# Altium schematic sheet Trap_PCB_SMT2024.SchDoc
size A4; SheetNumber: 1; SheetTotal: 1
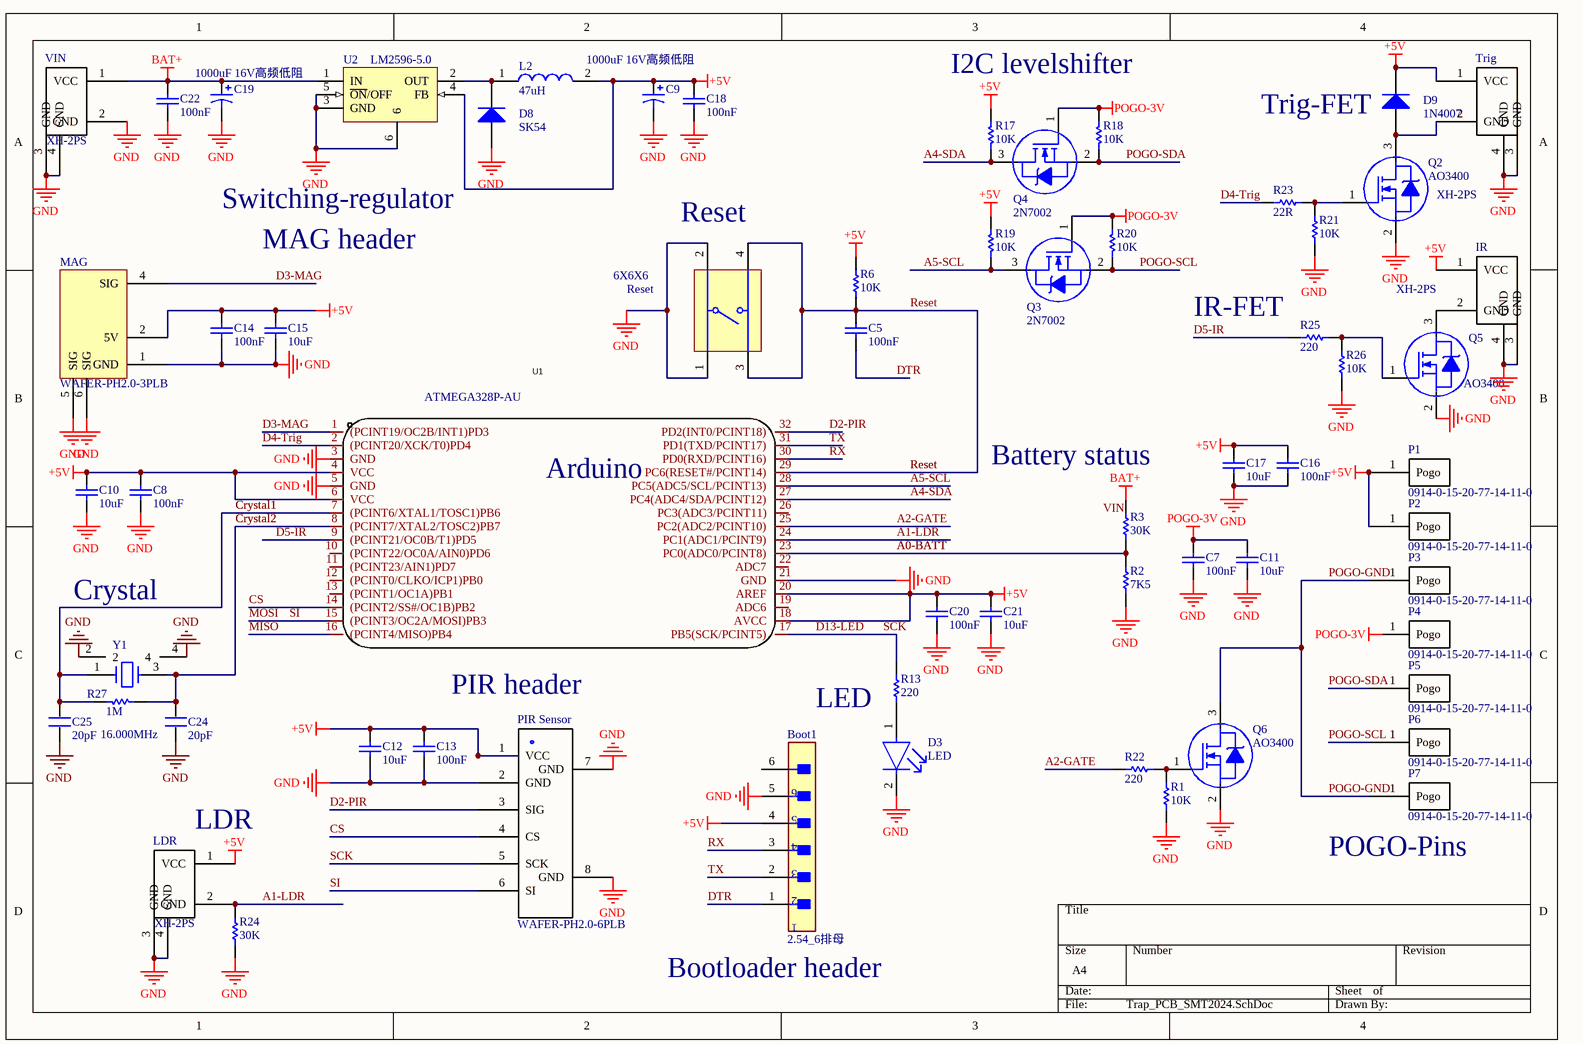
[diagram p0: Trap_PCB_SMT2024.SchDoc]

## Parts
Boot1  2.54_6排母  [FP-SWR25X-NRTC-S06-ST-BA-MFG]
C5  100nF  [0603C]
C7  100nF  [0603C]
C8  100nF  [0603C]
C9  1000uF 16V高频低阻  [CAP-SMD_BD10.0-L10.3-W10.3-LS11.3-FD]
C10  10uF  [0603C]
C11  10uF  [0603C]
C12  10uF  [0603C]
C13  100nF  [0603C]
C14  100nF  [0603C]
C15  10uF  [0603C]
C16  100nF  [0603C]
C17  10uF  [0603C]
C18  100nF  [0603C]
C19  1000uF 16V高频低阻  [CAP-SMD_BD10.0-L10.3-W10.3-LS11.3-FD]
C20  100nF  [0603C]
C21  10uF  [0603C]
C22  100nF  [0603C]
C24  20pF  [0603C]
C25  20pF  [0603C]
D3  LED  [0603LED]
D8  SK54  [SMB-K]
D9  1N4007  [SMA]
IR  XH-2PS  [CNS_2.5-2]
L2  47uH  [L10.8X10]
LDR  XH-2PS  [CNS_2.5-2]
MAG  WAFER-PH2.0-3PLB  [CNS-2.0-4]
P1  0914-0-15-20-77-14-11-0  [0914-0-15-20-77-14-11-0]
P2  0914-0-15-20-77-14-11-0  [0914-0-15-20-77-14-11-0]
P3  0914-0-15-20-77-14-11-0  [0914-0-15-20-77-14-11-0]
P4  0914-0-15-20-77-14-11-0  [0914-0-15-20-77-14-11-0]
P5  0914-0-15-20-77-14-11-0  [0914-0-15-20-77-14-11-0]
P6  0914-0-15-20-77-14-11-0  [0914-0-15-20-77-14-11-0]
P7  0914-0-15-20-77-14-11-0  [0914-0-15-20-77-14-11-0]
PIR_Sensor  WAFER-PH2.0-6PLB  [CNS-2.0-6]
Q2  AO3400  [SOT-23]
Q3  2N7002  [SOT-23]
Q4  2N7002  [SOT-23]
Q5  AO3400  [SOT-23]
Q6  AO3400  [SOT-23]
R1  10K  [0603R]
R2  7K5  [0603R]
R3  30K  [0603R]
R6  10K  [0603R]
R13  220  [0603R]
R17  10K  [0603R]
R18  10K  [0603R]
R19  10K  [0603R]
R20  10K  [0603R]
R21  10K  [0603R]
R22  220  [0603R]
R23  22R  [0603R]
R24  30K  [0603R]
R25  220  [0603R]
R26  10K  [0603R]
R27  1M  [0603R]
Reset  6X6X6  [SW-4P-6X6]
Trig  XH-2PS  [CNS_2.5-2]
U1  ATMEGA328P-AU  [TQFP-32_L7.0-W7.0-P0.80-LS9.0-BL]
U2  LM2596-5.0  [TO263-5]
VIN  XH-2PS  [CNS_2.5-2]
Y1  16.000MHz  [X3225]

## Nets
+5V: Boot1.4 C8.2 C9.1 C10.2 C12.2 C13.2 C14.2 C15.2 C16.2 C17.2 C18.1 C20.2 C21.2 D9.2(K) IR.1(VCC) L2.2 LDR.1(VCC) MAG.2(5V) P1.1(Pogo) P2.1(Pogo) PIR_Sensor.1(VCC) R6.1 R17.2 R19.2 Trig.1(VCC) U1.4(VCC) U1.6(VCC) U1.18(AVCC) U1.20(AREF) U2.4(FB)
GND: Boot1.5 C7.1 C8.1 C9.2 C10.1 C11.1 C12.1 C13.1 C14.1 C15.1 C16.1 C17.1 C18.2 C19.2 C20.1 C21.1 C22.2 C24.1 C25.1 D3.2(A) D8.1(A) IR.3(GND) IR.4(GND) LDR.3(GND) LDR.4(GND) MAG.1(GND) MAG.5(SIG) MAG.6(SIG) PIR_Sensor.2(GND) PIR_Sensor.7(GND) PIR_Sensor.8(GND) Q2.2 Q5.2 Q6.2 R1.1 R2.2 R21.1 R24.1 R26.1 Reset.1 Reset.2 Trig.3(GND) Trig.4(GND) U1.3(GND) U1.5(GND) U1.21(GND) U2.3(GND) U2.5(~{ON}/OFF) U2.6 VIN.2(GND) VIN.3(GND) VIN.4(GND) Y1.2 Y1.4
POGO-3V: C7.2 C11.2 P4.1(Pogo) Q3.1 Q4.1 R18.2 R20.2
VIN: C19.1 C22.1 R3.1 U2.1(IN) VIN.1(VCC)  [also labelled BAT+]
A0-BATT: R2.1 R3.2 U1.23(PC0(ADC0/PCINT8))
A1-LDR: LDR.2(GND) R24.2 U1.24(PC1(ADC1/PCINT9))
A2-GATE: R22.2 U1.25(PC2(ADC2/PCINT10))
A4-SDA: Q4.3 R17.1 U1.27(PC4(ADC4/SDA/PCINT12))
A5-SCL: Q3.3 R19.1 U1.28(PC5(ADC5/SCL/PCINT13))
Crystal1: C25.2 R27.2 U1.7((PCINT6/XTAL1/TOSC1)PB6) Y1.1
Crystal2: C24.2 R27.1 U1.8((PCINT7/XTAL2/TOSC2)PB7) Y1.3
CS: PIR_Sensor.4(CS) U1.14((PCINT2/SS#/OC1B)PB2)
D2-PIR: PIR_Sensor.3(SIG) U1.32(PD2(INT0/PCINT18))
D3-MAG: MAG.4(SIG) U1.1((PCINT19/OC2B/INT1)PD3)
D4-Trig: R23.2 U1.2((PCINT20/XCK/T0)PD4)
D5-IR: R25.2 U1.9((PCINT21/OC0B/T1)PD5)
D13-LED: PIR_Sensor.5(SCK) R13.2 U1.17(PB5(SCK/PCINT5))  [also labelled SCK]
DTR: Boot1.1 C5.1
MISO: U1.16((PCINT4/MISO)PB4)
MOSI: PIR_Sensor.6(SI) U1.15((PCINT3/OC2A/MOSI)PB3)  [also labelled SI]
POGO-GND: P3.1(Pogo) P7.1(Pogo) Q6.3
POGO-SCL: P6.1(Pogo) Q3.2 R20.1
POGO-SDA: P5.1(Pogo) Q4.2 R18.1
Reset: C5.2 R6.2 Reset.3 Reset.4 U1.29(PC6(RESET#/PCINT14))
RX: Boot1.3 U1.30(PD0(RXD/PCINT16))
TX: Boot1.2 U1.31(PD1(TXD/PCINT17))
NetD3_1: D3.1(C) R13.1
NetD8_2: D8.2(K) L2.1 U2.2(OUT)
NetD9_1: D9.1(A) Q2.3 Trig.2(GND)
NetIR_2: IR.2(GND) Q5.3
NetQ2_1: Q2.1 R21.2 R23.1
NetQ5_1: Q5.1 R25.1 R26.2
NetQ6_1: Q6.1 R1.2 R22.1

Not connected (* = marked no-connect by the designer): Boot1 6; U1 10((PCINT22/OC0A/AIN0)PD6) 11((PCINT23/AIN1)PD7) 12((PCINT0/CLKO/ICP1)PB0) 13((PCINT1/OC1A)PB1) 19(ADC6) 22(ADC7) 26(PC3(ADC3/PCINT11))

## Notes on the sheet
- I2C levelshifter
- (near D9) Trig-FET
- Switching-regulator
- (near MAG) MAG header
- (near Reset) Reset
- (near R25) IR-FET
- (near U1) Arduino
- Battery status
- Crystal
- PIR header
- LED
- (near LDR) LDR
- (near P7) POGO-Pins
- (near Boot1) Bootloader header

## Library data of the parts
Boot1 = f2cb566baf1c37ab5a3b8e90bbeafd6: CONN HEADER VERT 6POS 2.54MM; Manufacturer: Sullins; Conn Orientation: Straight; Current Rating: 3A; Temperature Range High: +85°C; Number Of Rows: 1; ComponentLink2URL: https://drawings-pdf.s3.amazonaws.com/11633.pdf; Octopart: https://octopart.com/swr25x-nrtc-s06-st-ba-sullins-20912730; RoHS: TRUE; Lead Free: Yes; Digikey Description: CONN HEADER VERT 6POS 2.54MM; Temperature: -25°C to +85°C; ComponentLink2Description: Datasheet; Category: Conn; Device Class L1: Connectors; Package: SWR25X-NRTC-S06-ST-BA; Pitch: 2.54mm
C5 C7 C8 C10-C17 C20 C21 = CAP-NP-2: Capacitor, Ceramic, 22 pF, +/-10 %, 100 V, -55 to 125 degC, 2-Pin THD, RoHS, Bulk; Max Input Voltage: 40 V; Min Input Voltage: 4.2 V; Output Current: 1.5 A; RoHSCompliant: true; Min Operating Temperature: 0 degC; Max Operating Temperature: 125 degC; Package Quantity: 50; ComponentLink2URL: http://capacitoredge.kemet.com/capedge2/DataSheet/Datasheet-C315C220K1G5TA.pdf?pn=C315C220K1G5TA{BULK}; Radiation Hardening: No; Pins: 3; Length: 10.28 mm; ComponentLink1URL: http://www.kemet.com/; ComponentLink2Description: Datasheet; Height: 9.28 mm; REACH SVHC: No SVHC; ComponentLink1Description: Manufacturer URL
C9 C19 = Cap Pol3: Polarized Capacitor (Surface Mount); Published: 8-Jun-2000; LatestRevisionDate: 17-Jul-2002; LatestRevisionNote: Re-released for DXP Platform.; PackageReference: C0805; Publisher: Altium Limited
C18 C22 = 电容: 贴片
C24 C25 = C
D3 = 8706943c75ba83719d021d2fdc84c58: LED YELLOW DIFFUSED T-1 T/H; Manufacturer: Broadcom; Wavelength: 585nm; Led Orientation: Straight; Luminous Intensity: 2.1mcd; Forward Voltage: 1.8V; Viewing Angle: 50°; Lead Free: Yes; Automotive: No; Device Class L1: Optoelectronics; Mouser Description: Standard LEDs - Through Hole Yellow Diffused 585nm 2.1mcd; Digikey Description: LED YELLOW DIFFUSED T-1 T/H; Temperature: -40°C to +100°C; Temperature Range High: +100°C; Package: 0; Category: Diode; Colour: Yellow
D8 D9 = Diode: Default Diode; Published: 8-Jun-2000; LatestRevisionDate: 17-Jul-2002; LatestRevisionNote: Re-released for DXP Platform.; PackageVersion: Sep-1996; PackageReference: SMC; Publisher: Altium Limited; PackageDescription: DO-214-AB/SMC; 2 C-Bend Leads; Body 7.9 x 5.9 mm, inc. leads (LxW); Code_JEDEC: DO-214-AB
IR LDR Trig VIN = JST HXP2
L2 = SPM6545VT-100M-D: Inductor; Manufacturer_Name: TDK; Datasheet Link: https://componentsearchengine.com/Datasheets/1/SPM6545VT-100M-D.pdf; Height: 4.5mm; Manufacturer_Part_Number: SPM6545VT-100M-D
MAG = MAG Sensor
P1-P7 = 0914-0-15-20-77-14-11-0: CONTACT SPRING LOADED T/H GOLD
PIR_Sensor = JST - PH-6p - 2.0mm
Q2-Q6 = IRF640N
R1 R6 R17-R21 R26 = RES-2: Little Demon(R) Carbon Composition Molded OD Series, 250 V, 10 KOhm, +/-5%, -70 to 130 degC, 2-Pin THD, RoHS, Bulk; Power Rating: 0.25W; Power (Watts): 0.25W,1/4W; Tolerance: ±5%; Online Catalog: OD,OF,OASeries,LittleDemon?; Mounting Technology: ThroughHole; Datasheet Version: 06/2016; RoHS Information: LittleDemon"E"SeriesMaterialDeclaration; Number of Terminations: 2; Temperature Coefficient: -; Height: -; Resistance (Ohms): 10k; Composition: CarbonComposition; Package Description: 2-Pin THD Resistor, Body 7 x 2.5 mm, Lead Dia. 0.6 mm; Size / Dimension: 0.098"Diax0.276"L(2.50mmx7.00mm); Category: Resistors; Manufacturer URL: http://www.ohmite.com/
R2 R3 R13 R22-R25 = RES-2: Little Demon(R) Carbon Composition Molded OD Series, 250 V, 10 KOhm, +/-5%, -70 to 130 degC, 2-Pin THD, RoHS, Bulk; Resistance (Ohms): 10k; Power Rating: 0.25W; Power (Watts): 0.25W,1/4W; Tolerance: ±5%; Online Catalog: OD,OF,OASeries,LittleDemon?; Mounting Technology: ThroughHole; Datasheet Version: 06/2016; RoHS Information: LittleDemon"E"SeriesMaterialDeclaration; Number of Terminations: 2; Temperature Coefficient: -; Height: -; Composition: CarbonComposition; Package Description: 2-Pin THD Resistor, Body 7 x 2.5 mm, Lead Dia. 0.6 mm; Size / Dimension: 0.098"Diax0.276"L(2.50mmx7.00mm); Category: Resistors; Manufacturer URL: http://www.ohmite.com/
R27 = Res1: Resistor; Value: 1K; Published: 8-Jun-2000; Revision: July-2002: Re-released for DXP Platform.; Publisher: Altium Limited
Reset = SW-SPST-4_A: Tactile Switch, SPST-NO, 0.05 A, 5 to 24 V, -25 to 70 degC, 4-Pin THD, RoHS, Bulk; Shielding: Shielded; Gender: Female; Radiation Hardening: No; Contact Plating: Gold; Height: 14.99 mm; Min Operating Temperature: -40 degC; Packaging: Tray; ComponentLink2Description: Datasheet; ComponentLink1URL: http://www.omron.com/; Lead Pitch: 1.27 mm; RoHSCompliant: true; Pins: 8; PackageReference: B3F-1000; Width: 25.4 mm; Contact Material: Brass; ComponentLink2URL: http://www.omron.com/ecb/products/pdf/en-b3f.pdf
U1 = ATMEGA328P-AU: Add into BOM: yes; CPU Core: AVR; Program Storage Size: 32KB; RAM Size: 2KB; GPIO Ports Number: 23; Operating Voltage Range: 1.8V~5.5V; CPU Maximum Speed: 20MHz; Program Memory Type: FLASH; EEPROM: 1KB; ADC (Bit): 10bit; Symbol: ATMEGA328P-AU; Device: ATMEGA328P-AU; Supplier Part: C14877; Manufacturer Part: ATMEGA328P-AU; Supplier Footprint: TQFP-32(7x7); JLCPCB Part Class: Extended Part; Datasheet: https://atta.szlcsc.com/upload/public/pdf/source/20140621/1457707095197.pdf; Supplier: LCSC; Convert to PCB: yes; DAC (Bit): -; PWM (Bit): -; 8Bit Timer: -; 16Bit Timer: -; 32Bit Timer: -; CAN: -; UART/USART: -; I2C: -; I2S: -; SPI: -; Universal Serial Bus: -; Internal Comparator: -; communication protocol: -; Real-Time Clock: -; Infrared Data Association: -; CCP Capture/Compare: -; LCD Module: -; LED Module: -; Secure Digital Input and Output: -; Direct Memory Access: -; Application Area: -
U2 = LM2596T-5.0: Simple Switcher Power Converter 150 kHz 3A Step Down Voltage Regulator; Note: Tab is connected to GND; Published: 15-Apr-2002; DatasheetVersion: Dec-1997; PackageVersion: 2000; PackageReference: T05D; Publisher: Altium Limited; PackageDescription: TO, Thru-Hole, Vertical, Heatsink Mounted; 5 Bent Staggered Leads; Pitch 1.7 mm; ComponentLink1Description: Manufacturer Link; ComponentLink1URL: http://www.national.com/; ComponentLink2Description: Datasheet; ComponentLink2URL: http://www.national.com/ds.cgi/LM/LM2596.pdf; ComponentLink3Description: URL Link1; ComponentLink3URL: http://www.national.com/pf/LM/LM2596.html
Y1 = R25010031: R25010031/工业C/消费A/晶体振荡器/8.000M/20pF/±30ppm/49USM/ROHS/-10℃~+70℃; 装配类型: SMD; 物料描述: 晶体振荡器/8.000M/20pF/±30ppm/49USM/ROHS/-10℃~+70℃; 物料编码: R25010031; 优选等级: 工业C/消费A